# EAGLE design dimmerPower9 (EAGLE 9.2.0)
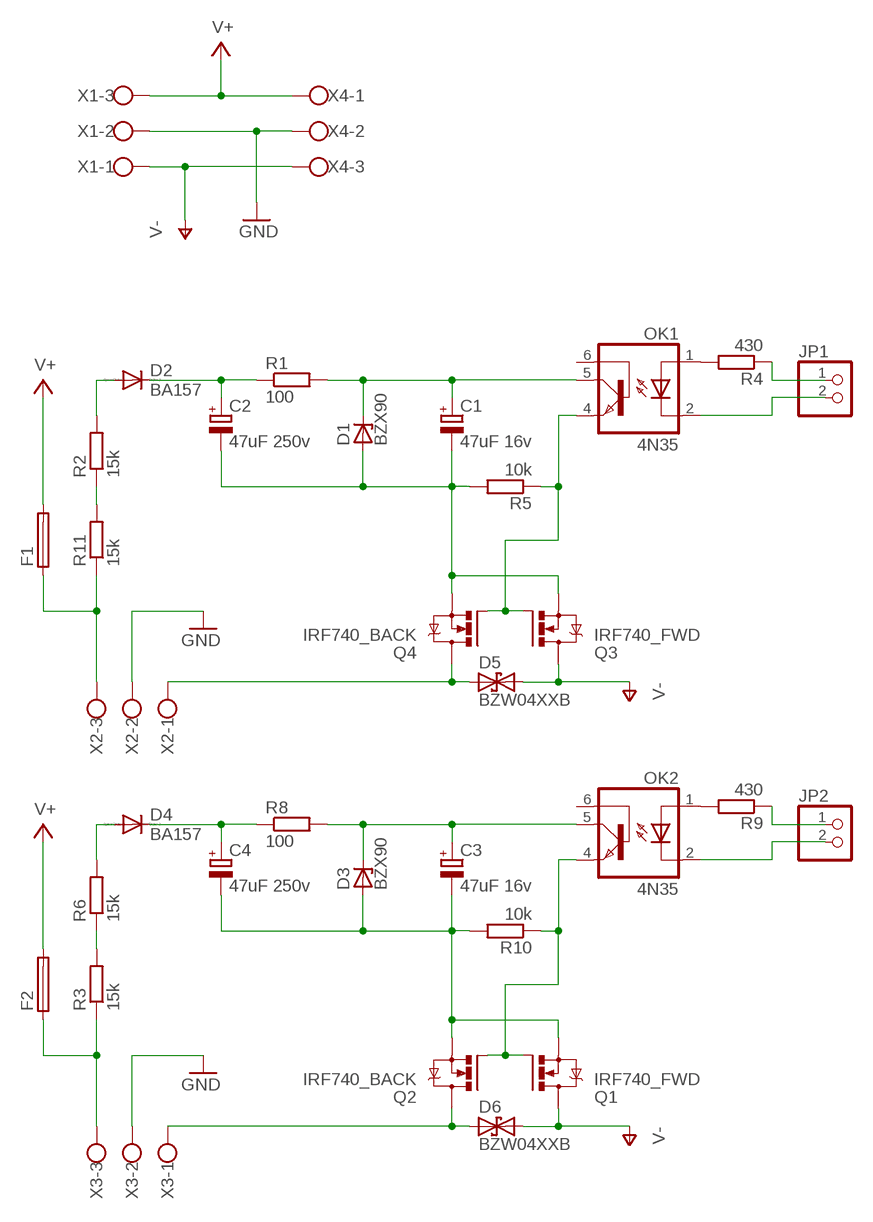
[diagram p0: schematic, sheet 1]

## Parts
C1  47uF 16v  CPOL-EUE2.5-6  [E2,5-6]
C2  47uF 250v  CPOL-EUE5-13  [E5-13]
C3  47uF 16v  CPOL-EUE2.5-6  [E2,5-6]
C4  47uF 250v  CPOL-EUE5-13  [E5-13]
D1  BZX90  [DO34Z7]
D2  BA157  [P1-10]
D3  BZX90  [DO34Z7]
D4  BA157  [P1-10]
D5  BZW04XXB  [F126Z12]
D6  BZW04XXB  [F126Z12]
F1  SH22,5  [SH22,5]
F2  SH22,5  [SH22,5]
JP1  PINHD-1X2  [1X02]
JP2  PINHD-1X2  [1X02]
OK1  4N35  [DIL06]
OK2  4N35  [DIL06]
Q1  IRF740_FWD  [TO220BV_FWD]
Q2  IRF740_BACK  [TO220BV_BACK]
Q3  IRF740_FWD  [TO220BV_FWD]
Q4  IRF740_BACK  [TO220BV_BACK]
R1  100  R-EU_0204/7  [0204/7]
R2  15k  R-EU_0613/15  [P0613/15]
R3  15k  R-EU_0613/15  [P0613/15]
R4  430  R-EU_0204/7  [0204/7]
R5  10k  R-EU_0204/7  [0204/7]
R6  15k  R-EU_0613/15  [P0613/15]
R8  100  R-EU_0204/7  [0204/7]
R9  430  R-EU_0204/7  [0204/7]
R10  10k  R-EU_0204/7  [0204/7]
R11  15k  R-EU_0613/15  [P0613/15]
X1  W237-103  [W237-103]
X2  W237-103  [W237-103]
X3  W237-103  [W237-103]
X4  W237-103  [W237-103]

## Nets
GND: X1.2 X2.2 X3.2 X4.2
N$1: C1.- C2.- D1.A Q3.S Q4.S R5.2
N$2: JP1.1 R4.1
N$3: OK1.1(A) R4.2
N$4: JP1.2 OK1.2(C)
N$5: F1.1 R11.1 X2.3
N$6: R3.2 R6.1
N$7: R2.1 R11.2
N$8: D2.A R2.2
N$9: C2.+ D2.C R1.1
N$10: C1.+ D1.C OK1.5(COL) R1.2
N$11: OK1.4(EMI) Q3.G Q4.G R5.1
N$12: D5.A Q4.D X2.1
N$13: D4.A R6.2
N$14: C4.+ D4.C R8.1
N$15: C3.+ D3.C OK2.5(COL) R8.2
N$16: OK2.1(A) R9.2
N$17: D6.A Q2.D X3.1
N$18: JP2.1 R9.1
N$19: JP2.2 OK2.2(C)
N$20: OK2.4(EMI) Q1.G Q2.G R10.1
N$21: C3.- C4.- D3.A Q1.S Q2.S R10.2
N$22: F2.1 R3.1 X3.3
V+: F1.2 F2.2 X1.3 X4.1
V-: D5.C D6.C Q1.D Q3.D X1.1 X4.3
Unconnected: OK1.6(BAS) OK2.6(BAS)

## Library data of the parts
C1-C4 = rcl:CPOL-EU: POLARIZED CAPACITOR, European symbol; SPICEPREFIX: C
D1 D3 = untitled:BZX90: Z DIODE
D2 D4 = diode:BA157: DIODE fast soft-recovery controlled avalanche rectifier
D5 D6 = untitled:BZW04XXB: DIODE uni and bidirectional supressor diode
F1 F2 = untitled:SH22,5: FUSE HOLDER grid 22,5 mm, OGN0031 8201, Schurter (Buerklin); MF: SCHURTER; MPN: 0031.8201; OC_FARNELL: 1162740; OC_NEWARK: 96F8317
JP1 JP2 = pinhead:PINHD-1X2: PIN HEADER
OK1 OK2 = optocoupler:4N35: MOTOROLA OPTO COUPLER; MF: FAIRCHILD SEMICONDUCTOR; MPN: 4N35; OC_FARNELL: 1328375; OC_NEWARK: 72K9946
Q1 Q3 = untitled:IRF740_FWD: N-CHANNEL MOS FET Drain back
Q2 Q4 = untitled:IRF740_BACK: N-CHANNEL MOS FET Drain back
R1 R4 R5 R8-R10 = rcl:R-EU_: RESISTOR, European symbol; SPICEPREFIX: R
R2 R3 R6 R11 = untitled:R-EU_: RESISTOR, European symbol; SPICEPREFIX: R
X1-X4 = con-wago-500:W237-103: WAGO SCREW CLAMP; MPN: 237-103; OC_FARNELL: unknown; OC_NEWARK: 18M7116

## Net classes
1 signal: width 1.27 mm, clearance 0.508 mm
2 power: width 2.54 mm, clearance 0.508 mm

## Board
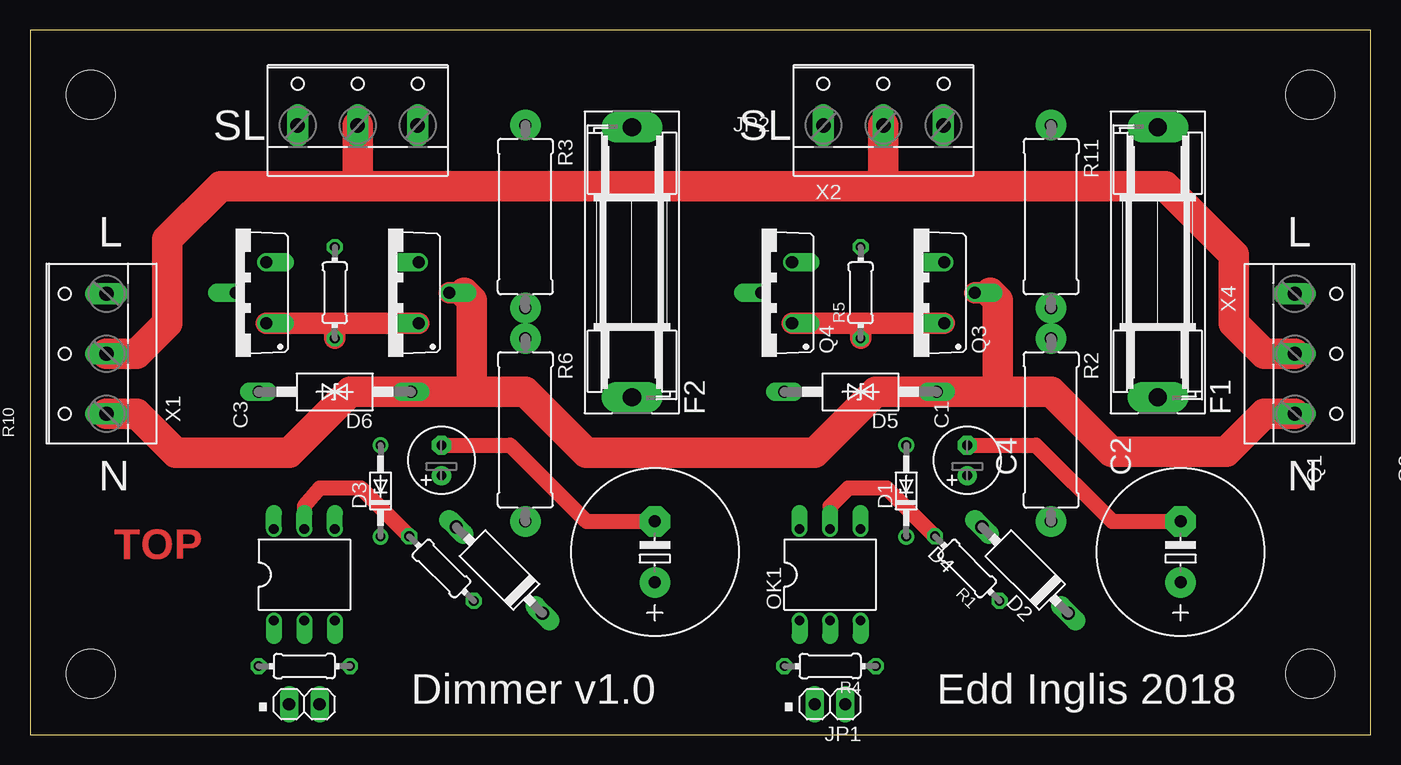
[diagram p1: board, top side]
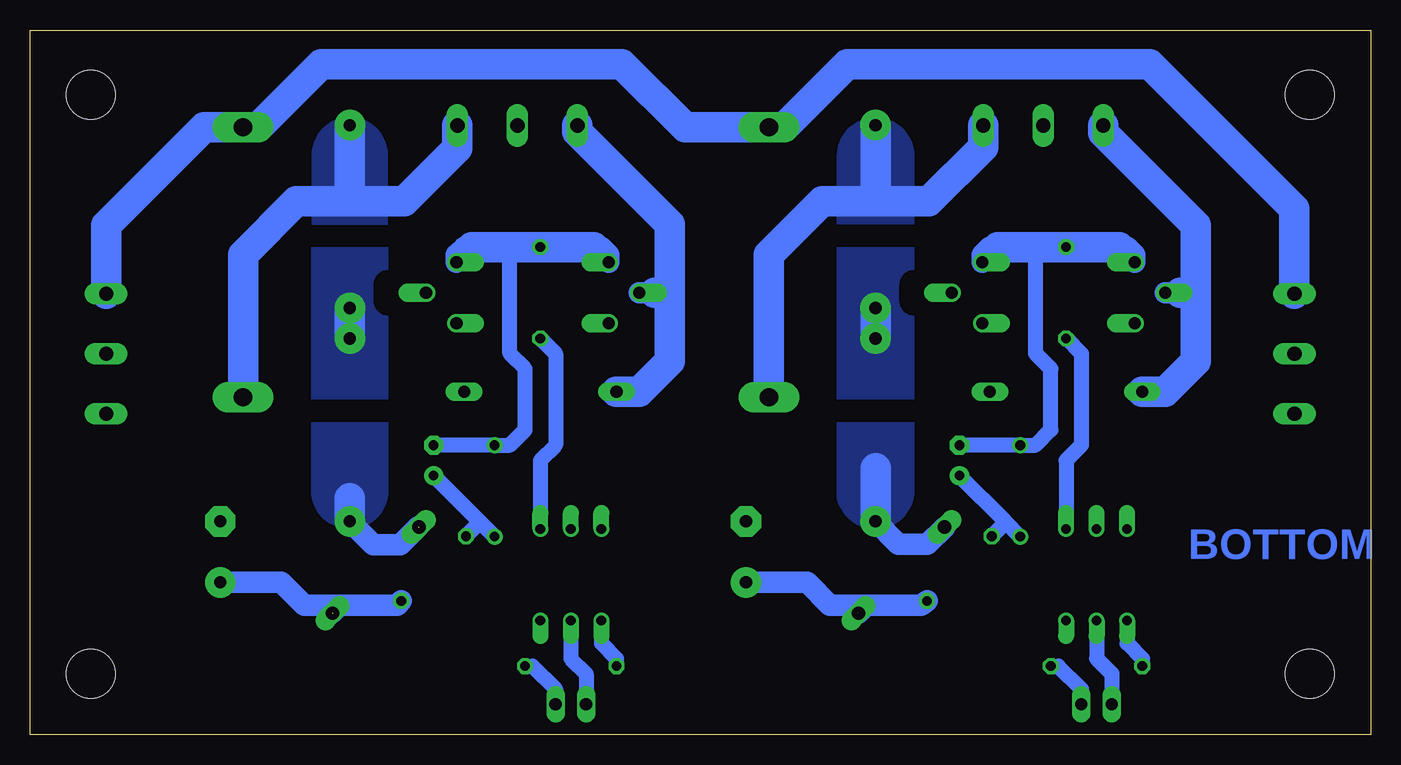
[diagram p2: board, bottom side, seen from below]

Size 111.74 x 58.73 mm. Coordinates in mm from the lower left corner, seen from the top.
Outline: 0,0 111.74,0 111.74,58.73 0,58.73 0,0
Copper layers (1*16): Top 0.035mm / dielectric 1.5mm / Bottom 0.035mm
Design rules "pcbtrain *": minimum track width 0.2mm, minimum drill 0.4mm, track to track 0.2mm, track to pad 0.2mm, pad to pad 0.2mm, via to via 0.2mm, smd to smd 0mil, copper to edge 10mil, drill to drill 0.2mm, minimum pad ring 10mil, minimum via ring 10mil, stop-mask expansion 0.125mm, vias tented up to drill 0mil, thermal gap 0mil
Holes 4.06 mm at 5.08,53.34 106.68,53.34 5.08,5.08 106.68,5.08

### Footprints (pad centres in the part's own frame; a part is rotated, then mirrored left to right if it is on the bottom)
E2,5-6 = drill 0.813 pad 1.6: + -1.27,0 | drill 0.813 pad 1.6 octagon: - 1.27,0
E5-13 = drill 1.016 pad 2.54: + -2.54,0 | drill 1.016 pad 2.54 octagon: - 2.54,0
DO34Z7 = drill 0.813: A 3.81,0; C -3.81,0
P1-10 = drill 1.118 long: A 5.08,0; C -5.08,0
F126Z12 = drill 1.016 long: A 6.35,0; C -6.35,0
SH22,5 = drill 1.524 pad 2.54 long: 1 -11.252,0; 2 11.252,0
1X02 = drill 1.016 long: 1 -1.27,0; 2 1.27,0
DIL06 = drill 0.813 offset: 1 -2.54,-3.81; 2 0,-3.81; 3 2.54,-3.81; 4 2.54,3.81; 5 0,3.81; 6 -2.54,3.81
TO220BV_FWD = drill 1.016 offset: D 0,-5.08; G -2.54,-2.54; S 2.54,-2.54
TO220BV_BACK = drill 1.016 offset: D 0,0; G -2.54,-2.54; S 2.54,-2.54
0204/7 = drill 0.813 octagon: 1 -3.81,0; 2 3.81,0
P0613/15 = drill 1.016 pad 2.54: 1 -7.62,0; 2 7.62,0
W237-103 = drill 1.194 long: 1 -5,-1.29; 2 0,-1.29; 3 5,-1.29

### Placement (x,y rotation side)
C1  78.11,22.86 90 top
C2  95.89,15.24 90 top
C3  34.29,22.86 90 top
C4  52.07,15.24 90 top
D1  73.03,20.32 90 top
D2  82.93,13.72 135 top
D3  29.21,20.32 90 top
D4  39.12,13.72 135 top
D5  69.22,28.57 180 top
D6  25.4,28.57 180 top
F1  93.98,39.37 90 top
F2  50.16,39.37 90 top
JP1  66.67,2.54 180 top
JP2  22.86,2.54 180 top
OK1  66.67,13.34 0 top
OK2  22.86,13.34 0 top
Q1  29.84,36.83 90 top
Q2  17.14,36.83 90 top
Q3  73.66,36.83 90 top
Q4  60.96,36.83 90 top
R1  78.11,13.84 135 top
R2  85.09,25.4 270 top
R3  41.27,43.18 270 top
R4  66.67,5.71 180 top
R5  69.22,36.83 90 top
R6  41.27,25.4 270 top
R8  34.29,13.84 135 top
R9  22.86,5.71 180 top
R10  25.4,36.83 90 top
R11  85.09,43.18 270 top
X1  5.08,31.75 90 top
X2  71.12,52.07 0 top
X3  27.3,52.07 0 top
X4  106.68,31.75 270 top

### Tracks (layer width: path | path; a pad name or v marks a point on that pad's centre or on a via)
GND
  Top 2.54: 71.12,45.72 27.3,45.72 | X2.2 71.12,45.72 | X3.2 27.3,45.72 | X1.2 8.89,31.75 11.43,34.29 11.43,41.27 15.88,45.72 27.3,45.72 | X4.2 102.87,31.75 100.33,34.29 100.33,40.01 94.61,45.72 71.12,45.72
N$1
  Top 1.27: C1.- 83.82,24.13 90.17,17.78 C2.-
  Bottom 1.27: C1.- D1.A 71.75,24.13 70.48,25.4 70.48,30.48 71.75,31.75 71.75,40.64
  Bottom 1.778: Q4.S 63.5,40.01 64.14,40.64 64.77,40.64 | Q3.S 76.2,40.01 75.56,40.64 74.93,40.64
  Bottom 2.54: 64.77,40.64 R5.2 71.75,40.64 74.93,40.64
N$2
  Bottom 1.27: JP1.1 67.94,3.81 69.85,5.71 R4.1
N$3
  Bottom 1.27: R4.2 62.87,6.35 64.14,7.62 OK1.1
N$4
  Bottom 1.27: OK1.2 66.67,6.35 65.41,5.08 JP1.2
N$5
  Bottom 2.54: F1.1 93.98,40.01 89.53,44.45 85.09,44.45 | 85.09,44.45 80.55,44.45 76.12,48.88 X2.3 | R11.1 85.09,44.45
  pour Bottom: 85.09,51.44 arc-90 88.27,48.26 88.27,42.55 81.92,42.55 81.92,48.26 arc-90
N$6
  Bottom 2.54: R3.2 R6.1
  pour Bottom: 38.1,27.94 44.45,27.94 44.45,40.64 38.1,40.64 38.1,38.73 arc-90 39.37,37.47 39.37,36.2 arc-90 38.1,34.92
N$7
  Bottom 2.54: R11.2 R2.1
  pour Bottom: 81.92,27.94 88.27,27.94 88.27,40.64 81.92,40.64 81.92,38.73 arc-90 83.19,37.47 83.19,36.2 arc-90 81.92,34.92
N$8  (1 unrouted)
  Bottom 1.778: 79.37,17.34 80.87,15.84 83.15,15.84 R2.2
  Bottom 2.54: R2.2 85.09,19.68
  pour Bottom: 85.09,17.14 arc90 88.27,20.32 88.27,26.04 81.92,26.04 81.92,20.32 arc90
N$9  (1 unrouted)
  Bottom 1.778: C2.+ 90.81,12.7 88.9,10.79 85.92,10.79 | 85.92,10.79 81.15,10.79 R1.1 | 85.92,10.79 86.56,10.16
N$10
  Top 1.27: OK1.5 66.67,19.05 68.17,20.55 71.4,20.55 R1.2
  Bottom 1.27: D1.C 74.3,17.78 | 74.3,17.78 C1.+ | R1.2 74.3,17.65 74.3,17.78
N$11
  Top 1.778: 69.22,34.29 Q4.G | Q3.G 69.22,34.29 | 69.22,34.29 R5.1
  Bottom 1.27: OK1.4 69.22,22.86 67.94,24.13 67.94,31.75 R5.1
N$12
  Bottom 1.778: Q4.D 59.69,36.83
  Bottom 2.54: 58.42,36.83 58.42,31.11 60.96,28.57 D5.A | 58.42,36.83 58.42,42.55 66.12,50.24 X2.1 | 59.69,36.83 58.42,36.83
N$13
  Bottom 1.778: D4.A 36.96,15.88 39.37,15.88 R6.2
  Bottom 2.54: R6.2 41.27,22.23
  pour Bottom: 38.1,26.04 38.1,20.32 arc90 41.27,17.14 arc77 44.45,19.68 44.45,26.04
N$14  (1 unrouted)
  Bottom 1.778: C4.+ 46.99,12.7 45.09,10.79 42.04,10.79 | 42.04,10.79 37.47,10.79 R8.1 | 42.04,10.79 D4.C
N$15
  Top 1.27: OK2.5 22.86,19.05 24.13,20.55 27.58,20.55 R8.2
  Bottom 1.27: D3.C 30.48,17.78 | 30.48,17.78 C3.+ | R8.2 30.48,17.65 30.48,17.78
N$16
  Bottom 1.27: R9.2 19.05,6.35 20.32,7.62 OK2.1
N$17
  Bottom 1.778: Q2.D 15.88,36.83
  Bottom 2.54: 14.61,36.83 14.61,42.45 22.3,50.15 X3.1 | 14.61,36.83 14.61,31.11 17.14,28.57 D6.A | 15.88,36.83 14.61,36.83
N$18
  Bottom 1.27: JP2.1 24.13,3.81 26.04,5.71 R9.1
N$19
  Bottom 1.27: OK2.2 22.86,6.35 21.59,5.08 JP2.2
N$20
  Top 1.778: 25.4,34.29 Q2.G | Q1.G 25.4,34.29 | 25.4,34.29 R10.1
  Bottom 1.27: OK2.4 25.4,22.86 24.13,24.13 24.13,31.75 R10.1
N$21
  Top 1.27: C4.- 46.35,17.78 40.01,24.13 C3.-
  Bottom 1.27: C3.- D3.A 27.94,24.13 26.67,25.4 26.67,30.48 27.94,31.75 27.94,40.64
  Bottom 1.778: Q2.S 19.68,40.01 20.32,40.64 20.95,40.64 | Q1.S 32.38,40.01 31.75,40.64 31.11,40.64
  Bottom 2.54: 20.95,40.64 R10.2 27.94,40.64 31.11,40.64
N$22
  Bottom 2.54: X3.3 32.3,48.98 36.83,44.45 41.27,44.45 | 41.27,44.45 45.72,44.45 50.16,40.01 F2.1 | R3.1 41.27,44.45
  pour Bottom: 38.1,42.55 44.45,42.55 44.45,48.26 arc90 41.27,51.44 arc90 38.1,48.26
V+
  Bottom 2.54: X4.1 105.39,42.47 97.23,50.62 F1.2 92.71,50.62 87.45,55.88 62.41,55.88 57.15,50.62 F2.2 48.9,50.62 43.64,55.88 18.41,55.88 6.37,43.84 X1.3
V-
  Top 1.778: 80.01,36.83 Q3.D | 36.2,36.83 Q1.D
  Top 2.54: 80.01,36.83 80.64,36.2 80.64,28.57 | 36.2,36.83 36.83,36.2 36.83,28.57 | X1.1 8.91,26.75 12.16,23.5 21.59,23.5 26.67,28.57 D6.C 36.83,28.57 | 36.83,28.57 41.27,28.57 46.35,23.5 65.41,23.5 70.48,28.57 D5.C 80.64,28.57 | X4.3 102.85,26.75 99.67,23.57 90.09,23.57 85.09,28.57 80.64,28.57

### Text on the board
Top: TOP
Bottom: BOTTOM
tPlace: SL | SL | L | L | N | N | Dimmer v1.0 | Edd Inglis 2018 | . | .